# EAGLE design femtoUSB_r1.0.0_panelized (EAGLE 6.5.0)
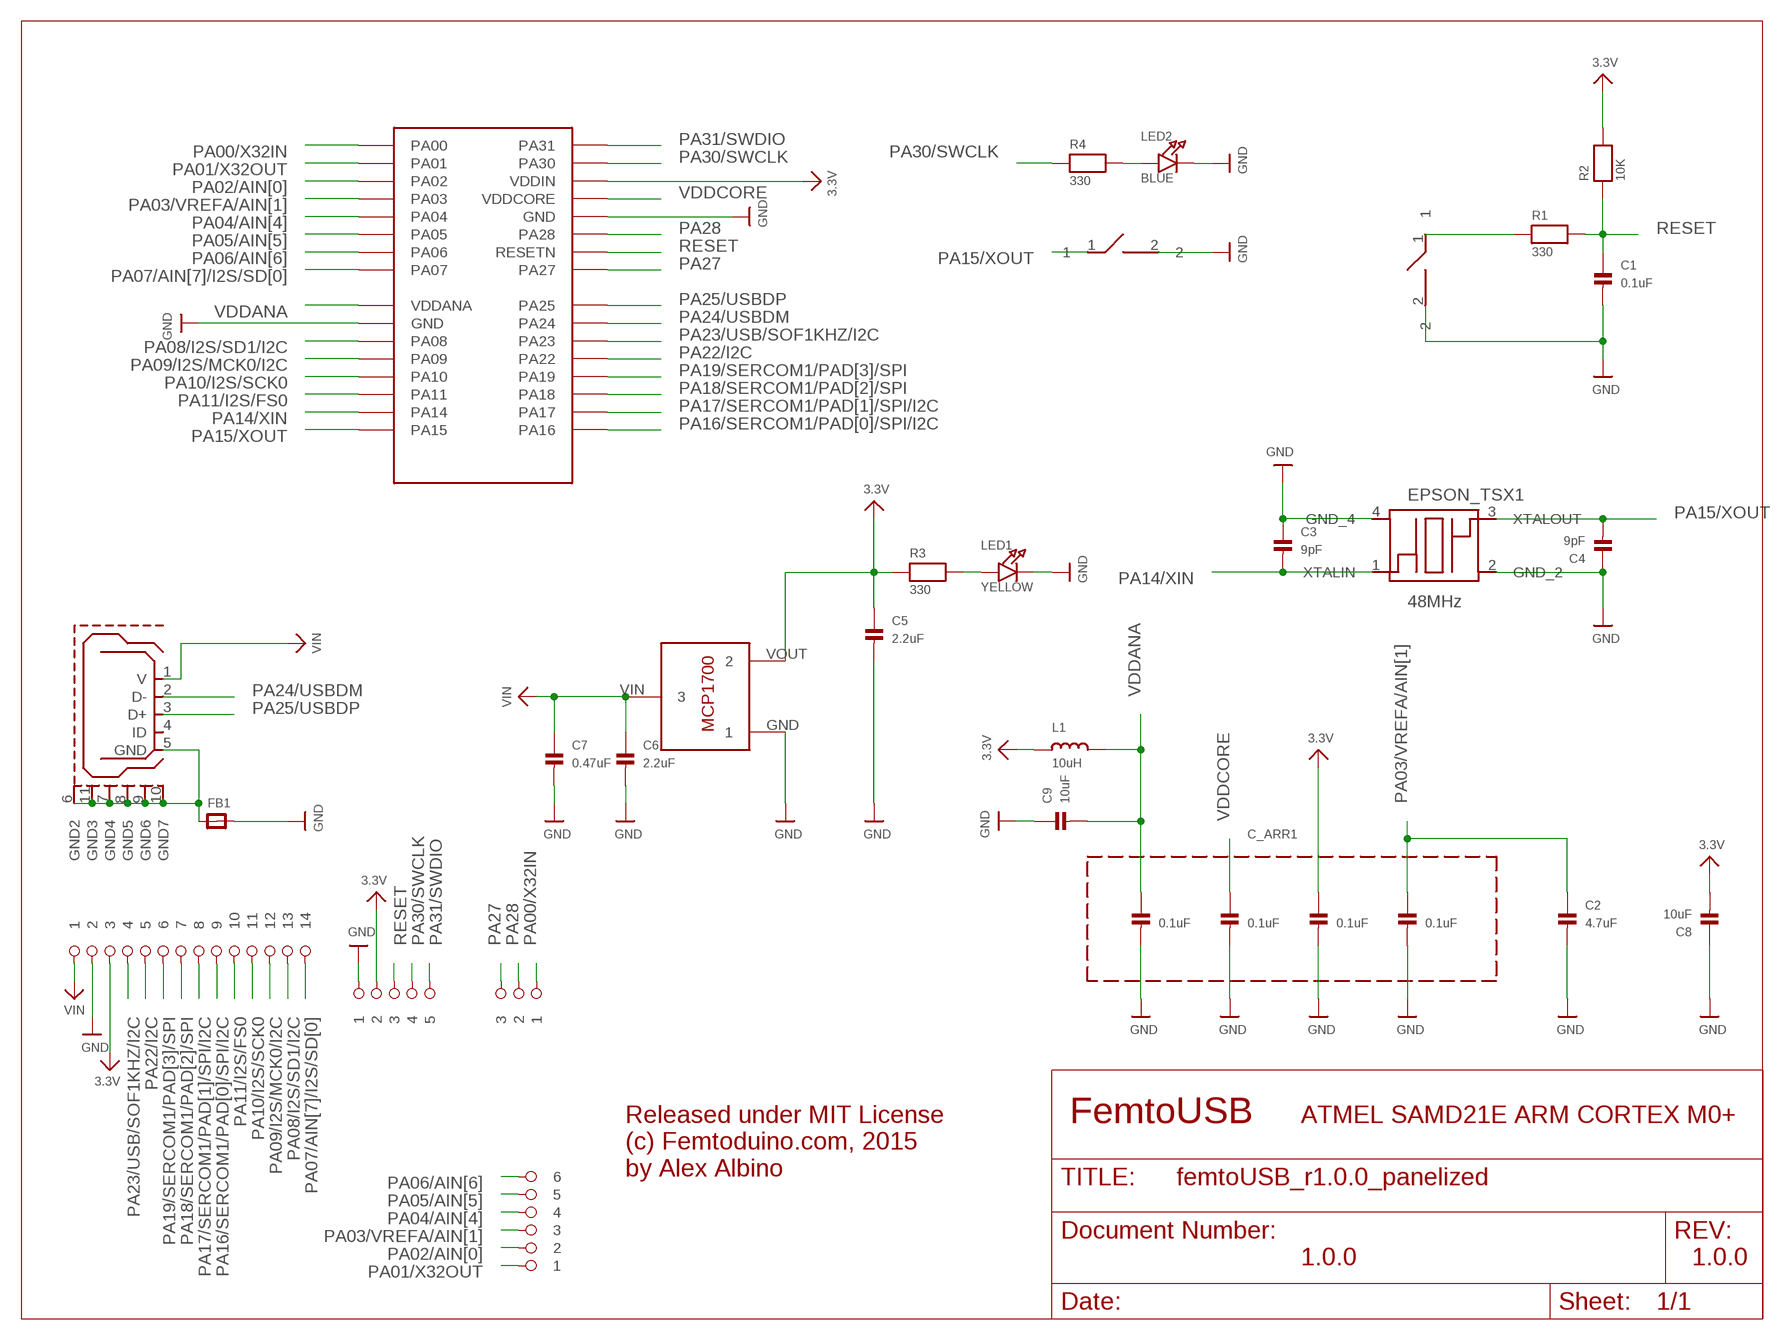
[diagram p0: schematic, sheet 1]

## Parts
BTN  OMRON B3U-300P(M)  SPST_SMD  [SPST_SMD]
C1  0.1uF  CAP_CERAMIC_0402MP  [_0402MP]
C2  4.7uF  CAP_CERAMIC_0402MP  [_0402MP]
C3  9pF  CAP_CERAMIC_0402MP  [_0402MP]
C4  9pF  CAP_CERAMIC_0402MP  [_0402MP]
C5  2.2uF  CAP_CERAMIC_0402MP  [_0402MP]
C6  2.2uF  CAP_CERAMIC_0402MP  [_0402MP]
C7  0.47uF  CAP_CERAMIC_0402MP  [_0402MP]
C8  10uF  CAP_CERAMIC_0402MP  [_0402MP]
C9  10uF  CAP_CERAMIC_0402MP  [_0402MP]
C_ARR1  0.1uF  KEMET_CERAMIC_CAPACITOR_ARRAY_1X4  [CAPACITOR_ARRAY_1206_MONO_1X4]
EPSON_TSX1  48MHz  TSX-3225  [TSX-3225]
FB1  FERRITE_0603MP  [_0603MP]
IC1  ATSAMD21E18A-MUT  [QFN32]
L1  10uH  INDUCTOR_0603MP  [_0603MP]
LDO_VREG  MCP1700T-3302E/TT  [MCP1700T-3302E/TT]
LED1  YELLOW  LED0603_NOOUTLINE  [CHIPLED_0603_NOOUTLINE]
LED2  BLUE  LED0603_NOOUTLINE  [CHIPLED_0603_NOOUTLINE]
MICRO_B_USB  USB_MICROB  [USB_MICROB_PACKAGE]
R1  330  RESISTOR_0402MP  [_0402MP]
R2  10K  RESISTOR_0402MP  [_0402MP]
R3  330  RESISTOR_0402MP  [_0402MP]
R4  330  RESISTOR_0402MP  [_0402MP]
U$6  1X14_ROUND  [1X14_ROUND]
U$7  1X3_ROUND  [1X3_ROUND]
U$9  1X5_ROUND  [1X5_ROUND]
U$12  1X6_ROUND  [1X6_ROUND]
U$38  SPST_SMD  [SPST_SMD]

## Nets
3.3V: C5.1 C8.2 C_ARR1.5 IC1.30(VDDIN) L1.1 LDO_VREG.VOUT R2.2 R3.1 U$6.P$3 U$9.P$2
GND: BTN.2 C1.2 C2.2 C3.1 C4.1 C5.2 C6.2 C7.2 C8.1 C9.1 C_ARR1.2 C_ARR1.4 C_ARR1.6 C_ARR1.8 EPSON_TSX1.2(GND_2) EPSON_TSX1.4(GND_4) FB1.2 IC1.10(GND) IC1.28(GND) LDO_VREG.GND LED1.C LED2.C U$6.P$2 U$9.P$1 U$38.2
N$1: LED1.A R3.2
N$13: LED2.A R4.2
N$26: BTN.1 R1.1
N$32: FB1.1 MICRO_B_USB.5(GND) MICRO_B_USB.6(GND2) MICRO_B_USB.7(GND4) MICRO_B_USB.8(GND5) MICRO_B_USB.9(GND6) MICRO_B_USB.10(GND7) MICRO_B_USB.11(GND3)
PA00/X32IN: IC1.1(PA00) U$7.P$1
PA01/X32OUT: IC1.2(PA01) U$12.P$1
PA02/AIN[0]: IC1.3(PA02) U$12.P$2
PA03/VREFA/AIN[1]: C2.1 C_ARR1.7 IC1.4(PA03) U$12.P$3
PA04/AIN[4]: IC1.5(PA04) U$12.P$4
PA05/AIN[5]: IC1.6(PA05) U$12.P$5
PA06/AIN[6]: IC1.7(PA06) U$12.P$6
PA07/AIN[7]/I2S/SD[0]: IC1.8(PA07) U$6.P$14
PA08/I2S/SD1/I2C: IC1.11(PA08) U$6.P$13
PA09/I2S/MCK0/I2C: IC1.12(PA09) U$6.P$12
PA10/I2S/SCK0: IC1.13(PA10) U$6.P$11
PA11/I2S/FS0: IC1.14(PA11) U$6.P$10
PA14/XIN: C3.2 EPSON_TSX1.1(XTALIN) IC1.15(PA14)
PA15/XOUT: C4.2 EPSON_TSX1.3(XTALOUT) IC1.16(PA15) U$38.1
PA16/SERCOM1/PAD[0]/SPI/I2C: IC1.17(PA16) U$6.P$9
PA17/SERCOM1/PAD[1]/SPI/I2C: IC1.18(PA17) U$6.P$8
PA18/SERCOM1/PAD[2]/SPI: IC1.19(PA18) U$6.P$7
PA19/SERCOM1/PAD[3]/SPI: IC1.20(PA19) U$6.P$6
PA22/I2C: IC1.21(PA22) U$6.P$5
PA23/USB/SOF1KHZ/I2C: IC1.22(PA23) U$6.P$4
PA24/USBDM: IC1.23(PA24) MICRO_B_USB.2(D-)
PA25/USBDP: IC1.24(PA25) MICRO_B_USB.3(D+)
PA27: IC1.25(PA27) U$7.P$3
PA28: IC1.27(PA28) U$7.P$2
PA30/SWCLK: IC1.31(PA30) R4.1 U$9.P$4
PA31/SWDIO: IC1.32(PA31) U$9.P$5
RESET: C1.1 IC1.26(RESETN) R1.2 R2.1 U$9.P$3
VDDANA: C9.2 C_ARR1.1 IC1.9(VDDANA) L1.2
VDDCORE: C_ARR1.3 IC1.29(VDDCORE)
VIN: C6.1 C7.1 LDO_VREG.VIN MICRO_B_USB.1(V) U$6.P$1
Unconnected: MICRO_B_USB.4(ID)

## Notes on the sheet
- FemtoUSB | ATMEL SAMD21E ARM CORTEX M0+
- Released under MIT License
  (c) Femtoduino.com, 2015
  by Alex Albino
- 1.0.0 | 1.0.0

## Library data of the parts
BTN U$38 = femtoduino:SPST_SMD
C1-C9 = microbuilder:CAP_CERAMIC: Ceramic Capacitors 0402 - 0402 Surface Mount Capacitors 16pF 50V 5% [Digikey: 445-4899-2-ND] 18pF 50V 5% [Digikey: 490-1281-2-ND] 22pF 50V 5% [Digikey: 490-1283-2-ND] 68pF 50V 5% [Digikey: 490-1289-2-ND] 0.1uF 10V 10% [Digikey: 490-1318-2-ND] 1.0uF 6.3V 10% [Digikey: 490-1320-2-ND] 0603 - 0603 Surface Mount Capacitors 16 pF 50V 5% [Digikey: 445-5051-2-ND] 22 pF 50V [Digikey: PCC220ACVTR-ND] 33 pF 50V 5% [Digikey: 490-1415-1-ND] 56pF 50V 5% [Digikey: 490-1421-1-ND] 220pF 50V 5% [Digikey: 445-1285-1-ND] 680 pF 50V 2200 pF 50V 5% C0G [Digikey: 445-1297-1-ND] 5600 pF 100V 5% X7R [Digikey: 478-3711-1-ND] 0.1 µF 25V 10% [Digikey: PCC2277TR-ND] 0.22 µF 16V 10% X7R [Digikey: 445-1318-1-ND] 1.0 µF 25V 10% [Digikey: 445-5146-2-ND] 0603 - RF Specific 3pF 250V +/-0.1pF RF [Digikey: 712-1347-1-ND] 18 pF 250V 5% [Digikey: 478-3505-1-ND or 712-1322-1-ND] 56 pF 250V 5% C0G RF [Digikey: 490-4867-1-ND] 68 pF 250V RF [Digikey: 490-4868-1-ND] 0805 - 0805 Surface Mount Capacitors 220 pF 250V 2% RF Ceramic Capacitor [Digikey: 712-1398-1-ND] 1000 pF 50V 2% NP0 Ceramic Capacitor [Digikey: 478-3760-1-ND] 0.1 µF 25V 10% Ceramic Capacitor [Digikey: PCC1828TR-ND] 1.0 µF 16V 10% Ceramic Capacitor[Digikey: 490-1691-2-ND] 10.0 µF 10V 10% Ceramic Capacitor[Digikey: 709-1228-1-ND] 10.0 uF 16V 10% Ceramic Capacitor [Digikey: 478-5165-2-ND] 47 uF 6.3V 20% Ceramic Capacitor [Digikey: 587-1779-1-ND or 399-5506-1-ND] 1206 - 1206 Surface Mount Capacitors 47uF 10V 20% Ceramic Capacitor [Digikey: 490-5528-1-ND or 399-5508-1-ND or 445-6010-1-ND] 100uF 6.3V -20%, +80% Y5V Ceramic Capacitor (Digikey: 490-4512-1-ND, Mouser: 81-GRM31CF50J107ZE1L)
C_ARR1 = array-capacitor:KEMET_CERAMIC_CAPACITOR_ARRAY_1X4
EPSON_TSX1 = crystals:TSX-3225; DIGIKEY_PART: TSX-3225 32.0000MF15X-B-ND
FB1 = microbuilder:FERRITE: Ferrite Bead 0603 MMZ1608B121C - 120 Ohm @ 100MHz, 600mA, 0.15 Ohm DC Resistance - Digikey: 445-2164-1-ND BK1608HW121-T - 120 Ohm, 600mA Ferrite Chip - Digikey: 587-1876-2-ND 0805 HZ0805B272R-10 - 2.7K Ohm @ 100MHz, 200mA, 0.8 Ohm DC Resistance - Digikey: 240-2504-1-ND (see also Murata BLM21BD272SN1L) MMZ2012Y152B - 1.5K Ohm @ 100MHz, 500mA, 0.4 Ohm DC Resistance - Digikey: 445-1560-1-ND - Mainly for high frequency (80-400MHz) MMZ2012R102A - 1K Ohm @ 100MHz, 500mA, 0.3 Ohm DC Resistance - Digikey: 445-1555-2-ND - More general purpose (10-200MHz)
IC1 = atmel-samd21:ATSAMD21E18A-MUT: This is the ATMEL SAMD21E QFN-32. ATSAMD21E18A
L1 = microbuilder:INDUCTOR: Inductors 0603: 10nH Ceramic Inductor - microwire antenna/RF (Digikey: 712-1434-2-ND) 0805: 560nH Ceramic Inductor - RF (Digikey: 553-1047-1-ND) 270nH Ceramic Inductor - Q = 40@250MHz, +-5%, 1 Ohm DC Resistance (Digikey: 535-10506-2-ND) 1007 (2518 Metric) SMT: 10µH 10% 250mOhm 820mA 1007 Inductor (Digikey: 587-2189-1-ND) 22µH 10% 500mOhm 580mA 1007 Inductor (Digikey: 587-2190-1-ND) 47µH 10% 950mOhm 420mA 1007 Inductor (Digikey: 587-2191-1-ND) 47µH 5% 100mOhm 1A 1008 Inductor (Digikey: 732-1816-1-ND) 5.0x5.0mm (Taiyo Yuden NR5040 Series) 6.8µH 20% 2.3A 64mOhm Inductor (Digikey: 587-2374-2-ND) 5.0x5.0mm (TDK VLC5045 Series) 4.7µH 20% 3.3A 34mOhm Inductor (Digikey: 445-6526-1-ND) 6.8µH 20% 2.7A 46mOhm Inductor (Digikey: 445-6527-1-ND) 6.0x6.0mm (TDK VLC6045 Series) 4.7µH 20% 3.8A 27mOhm Inductor (Digikey: 445-6538-2-ND) 6.8µH 20% 3A 41mOhm Inductor (Digikey: 445-6540-1-ND) 6.2µH 30% 2.2A 45mOhm Inductor (Digikey: SRR5028-6R2YCT-ND) - Not TDK VLC6045 but footprint should match 6.0x6.0mm (TDK SLF6045 Series) 6.8uH 30% 2A 33mOhm Inductor (Digikey: 445-4572-1-ND, Mouser: 810-SLF645T6R8N2R0PF)
LDO_VREG = MCP1700T-3302E_TT:MCP1700T-3302E/TT: Microchip LDO "MCP1700" in a 3-Pin SOT-23 package. ID: MCP1700T-3302E/TT
LED1 LED2 = microbuilder:LED: LED 0603 - 0603 Surface Mount Package 2mA: Green LED - Low Power (3.9mcd, 2ma, 1.7Vf) - Digikey: 475-2709-2-ND Orange LED - Low Power (9.8mcd, 2ma, 1.8Vf) - Digikey: 475-1194-2-ND Red LED - Low Power (5mcd, 2ma, 1.8Vf) - Digikey: 475-1195-2-ND Yellow LED - Low Power (7mcd, 2ma, 1.8Vf) - Digikey: 475-1196-2-ND 5mA: Blue LED - Low Power (17mcd, 5ma, 2.9Vf) - Digikey: LNJ937W8CRACT-ND 0805 - 0805 Surface Mount Package 2mA: Red LED (8.8mcd, 2mA, 1.8Vf, Clear) - Low Power [Digikey: 475-2510-1-ND] Green LED (5mcd, 2mA, 1.8Vf, Clear) - Low Power [Digikey: 475-2730-1-ND] Yellow LED (11.3mcd, 2mA, 1.8Vf, Clear) - Low Power [Digikey: 475-2555-1-ND] 20mA: Red LED (104mcd, 20mA, Diffused) - LS R976 [Digikey: 475-1278-6-ND] Red LED (12mcd, 20mA, 2.0Vf, Clear) - APT2012EC [Digikey: 754-1128-1-ND] Green LED (15mcd, 20mA, 2.2Vf, Clear) - APT2012GC [Digikey: 754-1131-1-ND] Orange LED (160mcd, 20mA, 2.1Vf, Clear) - APT2012SECK [Digikey: 754-1130-1-ND] 1206 - 1206 Surface Mount Package Green LED (26mcd, 20mA, Diffused) - LG N971 [Digikey: 475-1407-6-ND] Red LED (15mcd, 20mA, Diffused) - LH N974 [Digikey: 475-1416-6-ND]
MICRO_B_USB = femtoduino:USB_MICROB: This is the hirose ZX62-B-5PA(11) MICRO-USB B Type female connection.
R1-R4 = microbuilder:RESISTOR: Resistors 0402 - 0402 Surface Mount Package 22 Ohm 1% 1/16W [Digikey: 311-22.0LRTR-ND] 33 Ohm 5% 1/16W 1.0K 5% 1/16W 1.5K 5% 1/16W 2.0K 1% 1/16W 10.0K 1% 1/16W [Digikey: 311-10.0KLRTR-ND] 10.0K 5% 1/16W [Digikey: RMCF0402JT10K0TR-ND] 12.1K 1% 1/16W [Digikey: 311-22.0LRTR-ND] 100.0K 5% 1/16W 0603 - 0603 Surface Mount Package 0 Ohm 1/10 Watt 1% Resistor 15 Ohm 1/10 Watt 1% Resistor 33 Ohm 1/10 Watt 1% Resistor 49.9 Ohm 1/10 Watt 1% Resistor 100 Ohm 1/10 Watt 1% Resistor 150 Ohm 1/10 Watt 1% Resistor 240 Ohm 1/10 Watt 1% Resistor 390 Ohm 1/10 Watt 1% Resistor 560 Ohm 1/10 Watt 1% Resistor 680 Ohm 1/10 Watt 1% Resistor 750 Ohm 1/10 Watt 1% Resistor 1.0K Ohm 1/10 Watt 1% Resistor 1.5K Ohm 1/10 Watt 1% Resistor 2.0K Ohm 1/10 Watt 1% Resistor 2.2K Ohm 1/10 Watt 1% Resistor 3.3K Ohm 1/10 Watt 1% Resistor 4.7K Ohm 1/10 Watt 1% Resistor 10.0K Ohm 1/10 Watt 1% Resistor 12.0K Ohm 1/10 Watt 1% Resistor 12.1K Ohm 1/10 Watt 1% Resistor 20.0K Ohm 1/10 Watt 1% Resistor 33.0K Ohm 1/10 Watt 1% Resistor 100.0K Ohm 1/10 Watt 1% Resistor 0805 - 0805 Surface Mount Package 0 Ohm 1/8 Watt 1% Resistor 33 Ohm 1/8 Watt 1% Resistor 100 Ohm 1/8 Watt 1% Resistor 150 Ohm 1/8 Watt 1% Resistor 200 Ohm 1/8 Watt 1% Resistor 240 Ohm 1/8 Watt 1% Resistor 330 Ohm 1/8 Watt 1% Resistor 390 Ohm 1/8 Watt 1% Resistor 470 Ohm 1/8 Watt 1% Resistor 1.0K Ohm 1/8 Watt 1% Resistor 1.5K Ohm 1/8 Watt 1% Resistor 2.0K Ohm 1/8 Watt 1% Resistor 4.7K Ohm 1/8 Watt 1% Resistor 5.1K Ohm 1/8 Watt 1% Resistor 5.6K Ohm 1/8 Watt 1% Resistor 10.0K Ohm 1/8 Watt 1% Resistor 22.0K Ohm 1/8 Watt 1% Resistor 33.0K Ohm 1/8 Watt 1% Resistor 100K Ohm 1/8 Watt 1% Resistor 1206 - 1206 Surface Mount Package 2012 - 2010 Surface Mount Package 0.11 Ohm 1/2 Watt 1% Resistor - Digikey: RHM.11UCT-ND
U$6 = pins_1.27mm_pitch:1X14_ROUND
U$7 = pins_1.27mm_pitch:1X3_ROUND
U$9 = pins_1.27mm_pitch:1X5_ROUND
U$12 = pins_1.27mm_pitch:1X6_ROUND

## Board
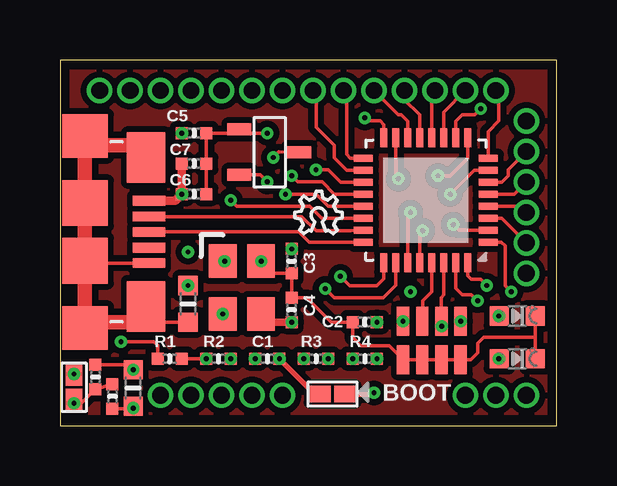
[diagram p1: board, top side]
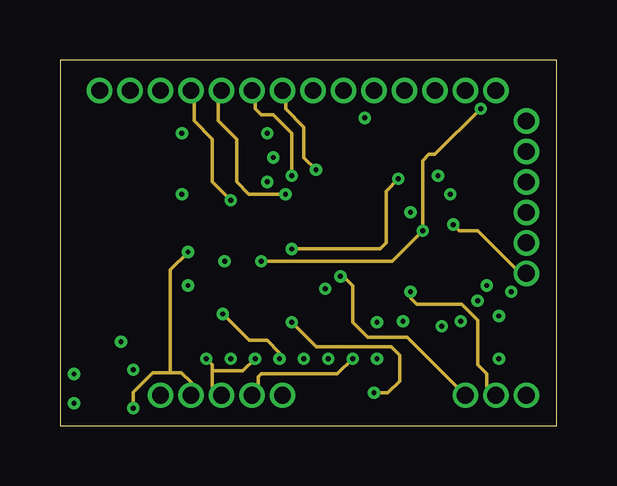
[diagram p2: board, inner layer Route2]
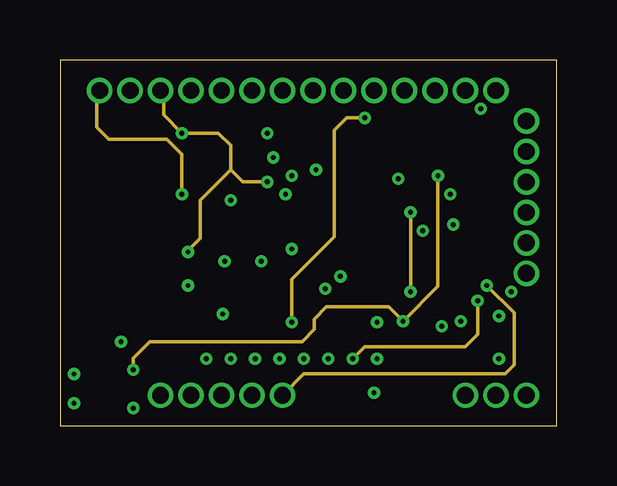
[diagram p3: board, inner layer Route15]
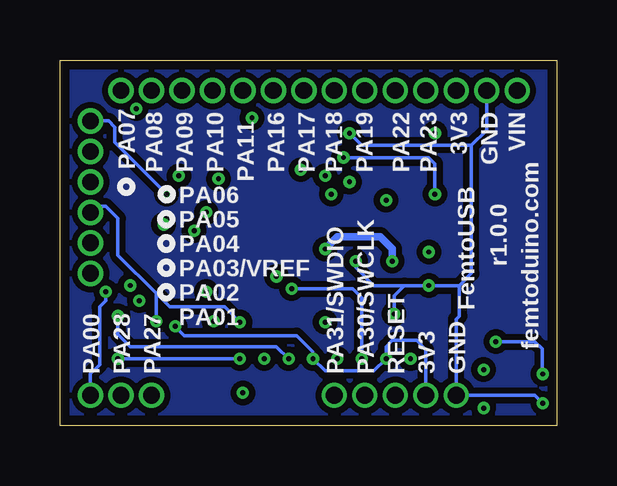
[diagram p4: board, bottom side, seen from below]

Size 20.7 x 15.24 mm. Coordinates in mm from the lower left corner, seen from the top.
Outline: 0,0 20.7,0 20.7,15.24 0,15.24 0,0
Copper layers (1+2*15+16): Top 0.035mm / dielectric 0.7mm / Route2 0.035mm / dielectric 0.15mm / Route15 0.035mm / dielectric 0.2mm / Bottom 0.035mm
Design rules "AQS_custom_4layer": minimum track width 5mil, minimum drill 5mil, track to track 6mil, track to pad 6mil, pad to pad 6mil, via to via 6mil, smd to smd 1mil, copper to edge 15mil, drill to drill 6mil, minimum pad ring 7mil, minimum via ring 3mil, stop-mask expansion 2mil, vias tented up to drill 10mil, thermal gap 10mil

### Footprints (pad centres in the part's own frame; a part is rotated, then mirrored left to right if it is on the bottom)
SPST_SMD = smd 0.889 x 0.699: 1 -0.508,0; 2 0.508,0
_0402MP = smd 0.5 x 0.5: 1 -0.508,0; 2 0.508,0
CAPACITOR_ARRAY_1206_MONO_1X4 = smd 0.52 x 1.2: 1 -1.2,0.8; 2 -1.2,-0.8; 3 -0.4,0.8; 4 -0.4,-0.8; 5 0.4,0.8; 6 0.4,-0.8; 7 1.2,0.8; 8 1.2,-0.8
TSX-3225 = smd 1.4 x 1.15: 1 -1.1,-0.8; 2 1.1,-0.8; 3 1.1,0.8; 4 -1.1,0.8
_0603MP = smd 0.8 x 0.8: 1 -0.762,0; 2 0.762,0
QFN32 = smd 0.8 x 0.3: 1 -2.6,1.75; 2 -2.6,1.25; 3 -2.6,0.75; 4 -2.6,0.25; 5 -2.6,-0.25; 6 -2.6,-0.75; 7 -2.6,-1.25; 8 -2.6,-1.75; 17 2.6,-1.75; 18 2.6,-1.25; 19 2.6,-0.75; 20 2.6,-0.25; 21 2.6,0.25; 22 2.6,0.75; 23 2.6,1.25; 24 2.6,1.75 | smd 0.3 x 0.8: 9 -1.75,-2.6; 10 -1.25,-2.6; 11 -0.75,-2.6; 12 -0.25,-2.6; 13 0.25,-2.6; 14 0.75,-2.6; 15 1.25,-2.6; 16 1.75,-2.6; 25 1.75,2.6; 26 1.25,2.6; 27 0.75,2.6; 28 0.25,2.6; 29 -0.25,2.6; 30 -0.75,2.6; 31 -1.25,2.6; 32 -1.75,2.6
MCP1700T-3302E/TT = smd 0.5 x 1: GND -0.95,-1.25; VIN 0,1.25; VOUT 0.95,-1.25
CHIPLED_0603_NOOUTLINE = smd 0.8 x 0.8: A 0,-0.75; C 0,0.75
USB_MICROB_PACKAGE = smd 0.4 x 1.35: 1 -1.3,1.47; 2 -0.64,1.47; 3 0,1.47; 4 0.66,1.47; 5 1.3,1.47 | smd 2.1 x 1.6: 6 -3.1,1.35; 11 3.1,1.35 | smd 1.8 x 1.9: 7 -4,-1.2; 10 4,-1.2 | smd 1.9 x 1.9: 8 -1.2,-1.2; 9 1.2,-1.2
1X14_ROUND = drill 0.7 pad 1: P$1 0,0; P$2 0,-1.27; P$3 0,-2.54; P$4 0,-3.81; P$5 0,-5.08; P$6 0,-6.35; P$7 0,-7.62; P$8 0,-8.89; P$9 0,-10.16; P$10 0,-11.43; P$11 0,-12.7; P$12 0,-13.97; P$13 0,-15.24; P$14 0,-16.51
1X3_ROUND = drill 0.7 pad 1: P$1 0,0; P$2 0,-1.27; P$3 0,-2.54
1X5_ROUND = drill 0.7 pad 1: P$1 0,0; P$2 0,-1.27; P$3 0,-2.54; P$4 0,-3.81; P$5 0,-5.08
1X6_ROUND = drill 0.7 pad 1: P$1 0,0; P$2 0,-1.27; P$3 0,-2.54; P$4 0,-3.81; P$5 0,-5.08; P$6 0,-6.35

### Placement (x,y rotation side)
BTN  0.58,1.6 270 top
C1  8.64,2.79 0 top
C2  12.7,4.32 180 top
C3  9.65,6.86 90 top
C4  9.65,4.83 270 top
C5  5.59,12.19 0 top
C6  5.59,9.65 0 top
C7  5.59,10.92 0 top
C8  2.18,1.22 270 top
C9  1.47,2.03 90 top
C_ARR1  15.49,3.56 0 top
EPSON_TSX1  7.58,5.76 270 top
FB1  5.33,5.08 90 top
IC1  15.24,9.4 180 top
L1  3.05,1.57 90 top
LDO_VREG  8.73,11.4 270 top
LED1  19.05,4.57 270 top
LED2  19.05,2.79 270 top
MICRO_B_USB  2.24,8.08 270 top
R1  4.57,2.79 0 top
R2  6.6,2.79 0 top
R3  10.67,2.79 0 top
R4  12.7,2.79 0 top
U$6  1.65,13.97 90 top
U$7  19.43,1.27 270 top
U$9  4.19,1.27 90 top
U$12  19.43,6.35 180 top
U$35  [OSHW_6X70_NOTEXT]  9.78,8 0 top
U$38  11.35,1.32 180 top

### Tracks (layer width: path | path; a pad name or v marks a point on that pad's centre or on a via)
3.3V  (via drill 0.2 pad 0.51)
  Top 0.152: LDO_VREG.VOUT 8.34,10.46 v8.64,10.16 | 15.99,4.45 C_ARR1.5 | IC1.30 15.99,5.45 15.88,5.33 15.88,4.38 C_ARR1.5 | C_ARR1.5 v15.9,4.14 | C8.2 2.95,0.71 v3.05,0.74 L1.1
  Route2 0.152: 4.6,2.21 3.86,2.21 3.05,1.4 v3.05,0.74 | 4.6,2.21 5.05,2.21 5.46,1.8 U$9.P$2 | v5.33,7.24 4.6,6.5 4.6,2.21
  Route15 0.152: U$6.P$3 4.32,13.84 4.32,12.95 C5.1 6.6,12.19 7.11,11.68 7.11,10.67 | v8.64,10.16 7.62,10.16 7.11,10.67 | 7.11,10.67 5.84,9.4 5.84,7.82 5.33,7.32 v5.33,7.24
  Bottom 0.152: U$9.P$2 5.46,3.17 5.84,3.56 6.86,3.56 7.11,3.3 R2.2 7.62,2.29 9.65,2.29 R3.1 10.16,3.07 10.85,3.76 15.52,3.76 v15.9,4.14
  other vias: 5.08,12.19 7.11,2.79 10.16,2.79
GND  (via drill 0.2 pad 0.51)
  Top 0.152: C6.2 C7.2 C5.2 7.3,12.19 LDO_VREG.GND 7.48,12.19 v8.64,12.19 | BTN.2 v0.58,0.94 0.89,0.94 C9.1 C8.1 | EPSON_TSX1.4 8.89,6.35 C3.1 C4.1 10.29,5.33 11.3,4.32 C2.2 12.19,3.68 12.54,3.33 13.72,3.33 C_ARR1.2 C_ARR1.4 C_ARR1.6 C_ARR1.8 17.11,2.76 17.4,3.05 17.4,3.43 17.65,3.68 19.8,3.68 | IC1.10 16.49,12.68 16.76,12.95 17.27,12.95 v17.53,13.21 | IC1.28 14.99,8.01 v15.11,8.13 | LED1.C 19.8,3.68 | 19.8,3.68 LED2.C
  Top 0.203: U$38.2 10.62,1.32 C1.2
  Route2 0.152: C1.2 9.14,3.05 8.64,3.56 7.88,3.56 EPSON_TSX1.2 | EPSON_TSX1.4 13.84,6.86 v15.11,8.13 15.11,11.05 15.37,11.3 15.62,11.3 v17.53,13.21
  Bottom 0.152: U$6.P$2 2.92,12.32 3.56,11.68 | 3.56,11.68 8.13,11.68 v8.64,12.19 | 4.06,5.84 FB1.2 6.35,5.84 | 4.06,5.84 3.56,6.35 3.56,11.68 | EPSON_TSX1.2 6.78,5.41 6.35,5.84 | v0.58,0.94 0.91,1.27 U$9.P$1 4.19,4.45 4.06,4.57 4.06,5.84 | EPSON_TSX1.4 8.38,6.6 7.62,5.84 6.35,5.84
  other vias: 5.33,5.84 6.78,4.66 8.38,6.86 9.14,2.79
N$1  (via drill 0.2 pad 0.51)
  Top 0.152: LED1.A v18.29,4.57
  Bottom 0.152: v18.29,4.57 18.29,3.81 17.78,3.3 11.68,3.3 R3.2
  other vias: 11.18,2.79
N$2
  pour Top (isolate 0.254): 0.25,14.99 20.32,14.99 20.32,0.51 0.25,0.51
  pour Bottom (isolate 0.254): 0.25,14.99 20.32,14.99 20.32,0.51 0.25,0.51
N$13  (via drill 0.2 pad 0.51)
  Top 0.152: LED2.A v18.29,2.79
  Bottom 0.152: v18.29,2.79 R4.2
  other vias: 13.21,2.79
N$26  (via drill 0.2 pad 0.51)
  Top 0.152: R1.1 4.06,3.35 3.91,3.5 v2.54,3.5 | BTN.1 v0.58,2.16
  Bottom 0.152: v2.54,3.5 0.91,3.5 0.61,3.2 0.61,2.26 v0.58,2.16
N$32
  Top 0.152: MICRO_B_USB.7 1.04,11.43 | MICRO_B_USB.6 3.59,11.43 | MICRO_B_USB.11 3.59,4.32 FB1.1 | 1.56,4.33 MICRO_B_USB.10 | MICRO_B_USB.5 1.14,6.78 MICRO_B_USB.9
  Top 0.61: 1.04,11.43 MICRO_B_USB.8 MICRO_B_USB.9 MICRO_B_USB.10 1.28,4.32 3.59,4.32 | 3.59,11.43 3.56,11.43 3.3,11.68 1.43,11.68 MICRO_B_USB.7
PA00/X32IN  (via drill 0.2 pad 0.51)
  Top 0.152: IC1.1 18.39,7.65 18.54,7.49 18.54,5.84 v18.8,5.59
  Bottom 0.152: v18.8,5.59 18.8,5.21 19.05,4.95 19.05,2.54 19.43,2.16 U$7.P$1
PA01/X32OUT  (via drill 0.2 pad 0.51)
  Top 0.152: IC1.2 16.62,8.15 v16.38,8.38
  Route2 0.152: v16.38,8.38 16.64,8.13 17.4,8.13 19.18,6.35 U$12.P$1
PA02/AIN[0]
  Top 0.152: IC1.3 18.4,8.65 U$12.P$2
PA03/VREFA/AIN[1]  (via drill 0.2 pad 0.51)
  Top 0.152: IC1.4 19.17,9.15 U$12.P$3
  Bottom 0.152: C_ARR1.7 16.69,5.52 | 16.69,5.52 18.29,7.11 18.29,8.64 18.8,9.15 19.17,9.15 U$12.P$3 | C2.1 13.84,4.95 16.13,4.95 16.69,5.52
  other vias: 16.69,4.36 13.21,4.32
PA04/AIN[4]
  Top 0.152: IC1.5 18.92,9.65 U$12.P$4
PA05/AIN[5]
  Top 0.152: IC1.6 18.4,10.15 18.67,10.41 18.67,10.67 U$12.P$5
PA06/AIN[6]  (via drill 0.2 pad 0.51)
  Top 0.152: IC1.7 17.25,10.65 v16.26,9.65
  Bottom 0.152: v16.26,9.65 18.41,11.81 18.41,12.45 18.67,12.7 U$12.P$6
PA07/AIN[7]/I2S/SD[0]
  Top 0.152: IC1.8 17.84,12.25 18.29,12.7 18.29,13.84 U$6.P$14
PA08/I2S/SD1/I2C
  Top 0.152: IC1.11 15.99,13.07 U$6.P$13
PA09/I2S/MCK0/I2C
  Top 0.152: IC1.12 15.49,13.84 U$6.P$12
PA10/I2S/SCK0
  Top 0.152: IC1.13 14.99,12.95 14.35,13.59 U$6.P$11
PA11/I2S/FS0
  Top 0.152: IC1.14 14.49,12.69 14.22,12.95 14.1,12.95 U$6.P$10
PA14/XIN  (via drill 0.2 pad 0.51)
  Top 0.152: EPSON_TSX1.1 v6.86,6.86 | v14.1,10.29 13.99,10.43 IC1.15
  Route2 0.152: C3.2 13.34,7.37 13.59,7.62 13.59,9.78 v14.1,10.29
  Bottom 0.305: v6.86,6.86 6.86,7.37 7.37,7.87 9.14,7.87 C3.2
  other vias: 9.65,7.37
PA15/XOUT  (via drill 0.2 pad 0.51)
  Top 0.152: 8.72,4.32 EPSON_TSX1.3 | IC1.16 13.49,12.54 13.34,12.7 12.83,12.7 v12.7,12.83
  Top 0.203: U$38.1 13.03,1.32 v13.08,1.37
  Top 0.305: C4.2 8.72,4.32
  Route2 0.152: v13.08,1.37 13.66,1.37 14.15,1.85 14.15,2.95 13.79,3.3 10.67,3.3 C4.2
  Route15 0.152: v12.7,12.83 11.94,12.83 11.43,12.32 11.43,7.87 9.65,6.1 C4.2
  other vias: 9.65,4.32
PA16/SERCOM1/PAD[0]/SPI/I2C
  Top 0.152: IC1.17 12.09,11.15 11.94,11.3 11.94,13.84 U$6.P$9
PA17/SERCOM1/PAD[1]/SPI/I2C
  Top 0.152: IC1.18 11.96,10.65 11.43,11.18 11.43,11.68 10.67,12.45 10.67,13.84 U$6.P$8
PA18/SERCOM1/PAD[2]/SPI  (via drill 0.2 pad 0.51)
  Top 0.152: IC1.19 11.7,10.15 11.18,10.67 v10.67,10.67
  Route2 0.152: v10.67,10.67 10.16,11.18 10.16,12.45 9.4,13.21 9.4,13.84 U$6.P$7
PA19/SERCOM1/PAD[3]/SPI  (via drill 0.2 pad 0.51)
  Top 0.152: IC1.20 11.43,9.65 10.92,10.16 9.91,10.16 v9.65,10.41
  Route2 0.152: v9.65,10.41 9.65,12.19 8.89,12.95 8.38,12.95 8.13,13.21 8.13,13.84 U$6.P$6
PA22/I2C  (via drill 0.2 pad 0.51)
  Top 0.152: IC1.21 11.17,9.15 10.67,9.65 v9.4,9.65
  Route2 0.152: v9.4,9.65 7.87,9.65 7.37,10.16 7.37,11.94 6.6,12.7 6.6,13.84 U$6.P$5
PA23/USB/SOF1KHZ/I2C  (via drill 0.2 pad 0.51)
  Top 0.152: IC1.22 10.91,8.65 10.41,9.14 7.37,9.14 v7.11,9.4
  Route2 0.152: v7.11,9.4 6.35,10.16 6.35,11.94 5.59,12.7 5.59,13.84 U$6.P$4
PA24/USBDM
  Top 0.152: MICRO_B_USB.2 10.08,8.72 10.67,8.13 12.11,8.13 IC1.23
PA25/USBDP
  Top 0.152: MICRO_B_USB.3 9.96,8.08 10.39,7.65 IC1.24
PA27  (via drill 0.2 pad 0.51)
  Top 0.152: IC1.25 13.49,6.12 13.21,5.84 12.06,5.84 v11.68,6.22
  Route2 0.152: v11.68,6.22 11.81,6.22 12.19,5.84 12.19,4.32 12.83,3.68 14.48,3.68 U$7.P$3
PA28  (via drill 0.2 pad 0.51)
  Top 0.152: IC1.27 14.49,8.78 v14.61,8.89
  Route2 0.152: v14.61,5.59 14.61,5.31 14.86,5.05 16.74,5.05 17.4,4.39 17.4,2.54 17.78,2.16 17.78,1.65 U$7.P$2
  Route15 0.152: v14.61,8.89 v14.61,5.59
PA30/SWCLK  (via drill 0.2 pad 0.51)
  Top 0.152: IC1.31 16.49,5.74 16.76,5.46 17.14,5.46 v17.4,5.21
  Route2 0.152: R4.1 11.56,2.16 8.38,2.16 8.26,2.03 8.26,1.52 U$9.P$4
  Route15 0.152: v17.4,5.21 17.4,3.81 16.89,3.3 12.7,3.3 R4.1
  other vias: 12.19,2.79
PA31/SWDIO  (via drill 0.2 pad 0.51)
  Top 0.152: IC1.32 16.99,6.25 17.14,6.1 17.53,6.1 v17.78,5.84
  Route15 0.152: v17.78,5.84 18.92,4.7 18.92,2.54 18.54,2.16 10.16,2.16 U$9.P$5
RESET  (via drill 0.2 pad 0.51)
  Top 0.152: R1.2 R2.1 | IC1.26 13.99,5.86 13.46,5.33 11.43,5.33 v11.05,5.71
  Route2 0.152: R2.1 6.35,2.54 6.35,2.29 | 6.35,2.29 6.35,1.65 U$9.P$3 | C1.1 7.62,2.29 6.35,2.29
  Bottom 0.152: v11.05,5.71 8.51,5.71 8.13,5.33 C1.1
  other vias: 6.1,2.79 8.13,2.79
VDDANA  (via drill 0.2 pad 0.51)
  Top 0.152: IC1.9 16.99,11.15 16.26,10.41 v15.75,10.41 | C9.2 2.85,2.54 L1.2
  Route15 0.152: v15.75,10.41 15.75,5.81 C_ARR1.1 13.7,4.95 11.1,4.95 10.59,4.45 10.59,4.01 10.08,3.5 3.73,3.5 3.05,2.82 L1.2
  other vias: 14.29,4.36 3.05,2.34
VDDCORE
  Top 0.152: IC1.29 15.49,5.58 15.11,5.21 15.11,4.38 C_ARR1.3
VIN  (via drill 0.2 pad 0.51)
  Top 0.152: LDO_VREG.VIN 9.12,11.41 v8.89,11.18
  Top 0.356: MICRO_B_USB.1 4.8,9.38 C6.1 C7.1
  Route15 0.152: U$6.P$1 1.52,13.84 1.52,12.45 2.03,11.94 4.45,11.94 5.08,11.3 C6.1
  Bottom 0.152: v8.89,11.18 5.33,11.18 C7.1 C6.1
  other vias: 5.08,9.65

### Text on the board
tNames: BOOT
bNames: VIN | GND | 3V3 | PA23 | PA22 | PA19 | PA18 | PA17 | PA16 | PA11 | PA10 | PA09 | PA08 | PA07 | PA06 | PA05 | r1.0.0 | PA04 | PA03/VREF | FemtoUSB | PA02 | PA01 | femtoduino.com | GND | 3V3 | RESET | PA30/SWCLK | PA31/SWDIO | PA27 | PA28 | PA00